# Altium schematic sheet TC_SMPS.SchDoc
size A4
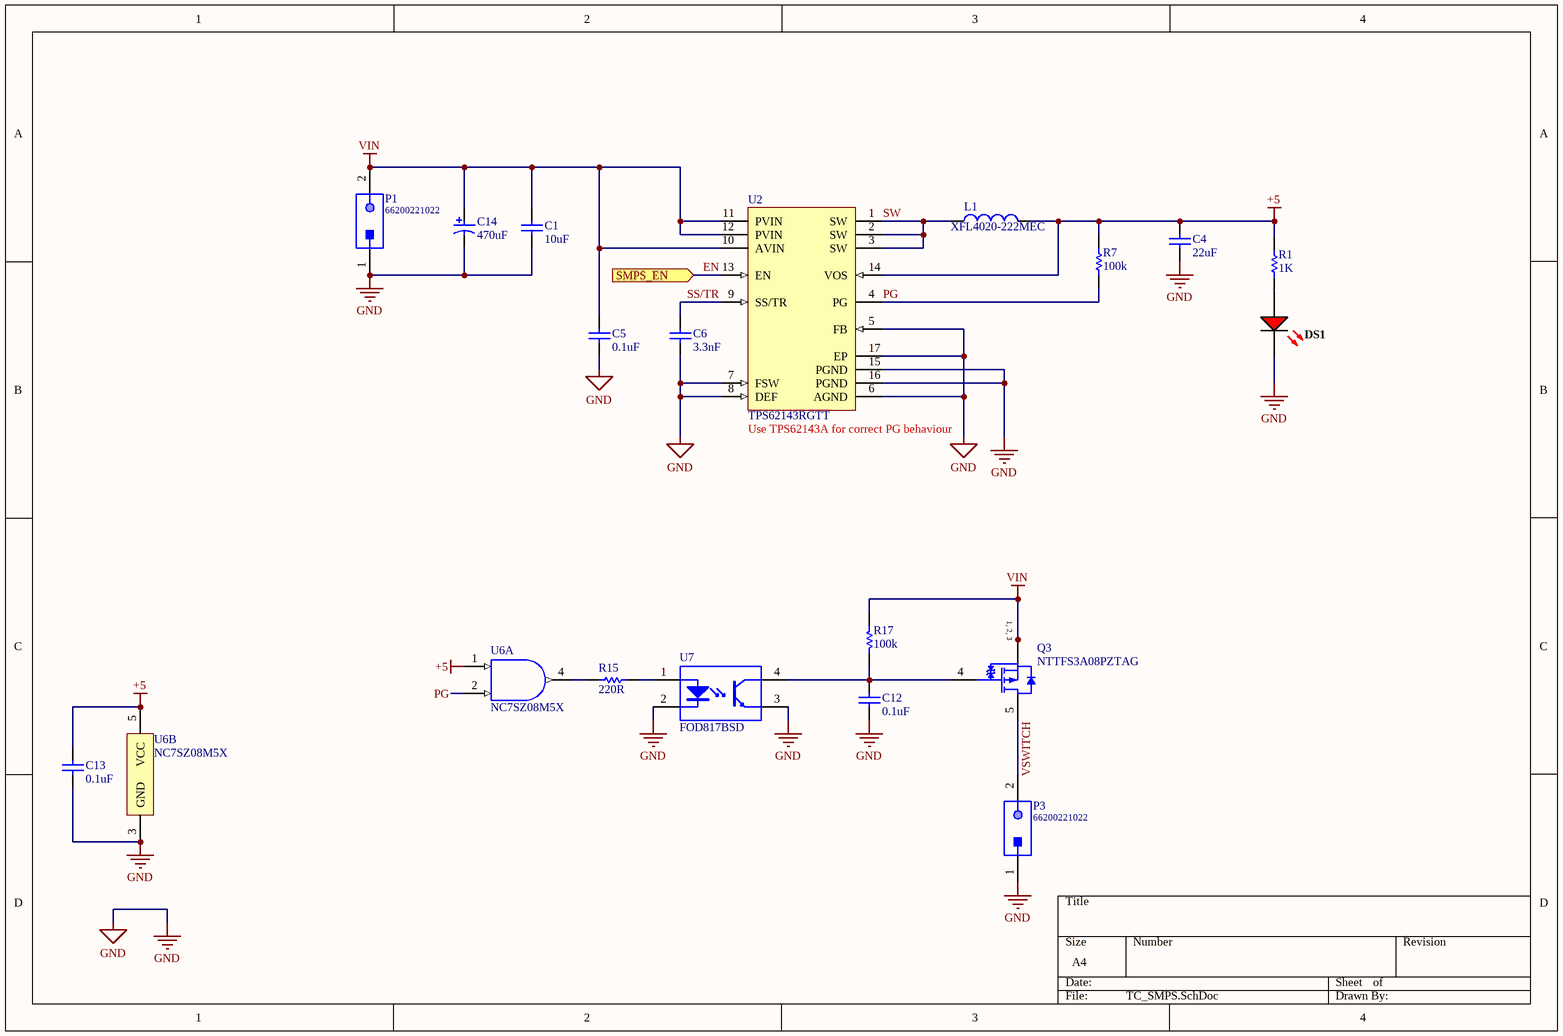
[diagram p0: TC_SMPS.SchDoc]

## Parts
C1  10uF  [CAPC1210(3225)210_M]
C4  22uF  [CAPC2013X95X45ML15T25]
C5  0.1uF  [CAPC1608X87X35NL15T15]
C6  3.3nF  [CAPC1608X87X35NL15T15]
C12  0.1uF  [CAPC1608X87X35NL15T15]
C13  0.1uF  [CAPC1608X87X35NL15T15]
C14  470uF  [PNSC-FK-V-F_V]
DS1  APG1608SURKC/T  [KING-LED0603-25-RED_V]  (value not drawn)
L1  XFL4020-222MEC  [COIL-IND-2_V]
P1  66200221022  [66200221022]
P3  66200221022  [66200221022]
Q3  NTTFS3A08PZTAG  [ONSC-WDFN-8-511AB_V]
R1  1K  [RESC1608X55X30LL15T15]
R7  100k  [RESC1608X55X25ML10T15]
R15  220R  [RESC1609X50X30LL10T20]
R17  100k  [RESC1608X55X25ML10T15]
U2  TPS62143RGTT  [RGT0016C_V]
U6  NC7SZ08M5X  [FAIR-SOT23-5_V]  (parts A,B of 2)
U7  FOD817BSD  [FAIR-MDIP-4_V]

## Ports
SMPS_EN (in)

## Nets
+5: C4.2 C13.1 L1.2 R1.2 R7.2 U2.14(VOS) U6.1(A) U6.5(VCC)
GND: C1.1 C4.1 C5.2 C6.1 C12.2 C13.2 C14.2 DS1.2(K) P1.1 P3.1 U2.5(FB) U2.6(AGND) U2.7(FSW) U2.8(DEF) U2.15(PGND) U2.16(PGND) U2.17(EP) U6.3(GND) U7.2(CATHODE) U7.3(EMITTER)
VIN: C1.2 C5.1 C14.1 P1.2 Q3.1(S) Q3.2(S) Q3.3(S) R17.2 U2.10(AVIN) U2.11(PVIN) U2.12(PVIN)
EN: U2.13(EN) ; port SMPS_EN
PG: R7.1 U2.4(PG) U6.2(B)
SS/TR: C6.2 U2.9(SS/TR)
SW: L1.1 U2.1(SW) U2.2(SW) U2.3(SW)
VSWITCH: P3.2 Q3.5(D)
NetC12_1: C12.1 Q3.4(G) R17.1 U7.4(COLLECTOR)
NetDS1_1: DS1.1(A) R1.1
NetR15_1: R15.1 U6.4(Y)
NetR15_2: R15.2 U7.1(ANODE)

## Notes on the sheet
- (near U2) Use TPS62143A for correct PG behaviour
- (in symbol CMP-1058-01043-1) 1, 2, 3

## Library data of the parts
C1 = CMP-1038-02235-1: CAP 10uF 35V ±20% 1210 (3225 Metric) Thickness 2.1mm SMD; Tolerance: Â±20%; Case-Metric: 3225; Case-EIA: 1210; Technology: SMT; Rated Voltage: 35 V; Value: 10uF; Max Thickness: 2.1 mm
C4 = CMP-2007-00096-1: Manufacturer: Murata; Part Number: GRM219R61A226MEA0D
C5 C12 C13 = CMP-2006-03300-1: Part Number: C0603X104K5RACTU; Manufacturer: Kemet
C6 = CMP-2006-03881-1: Part Number: C0603C332K5RAC7867; Manufacturer: Kemet
C14 = CMP-2000-06204-1: Aluminum Electrolytic Capacitor, 470 uF, +/- 20%, 16 V, 2-Pin SMD (Size Code F), -55 to 105 degC, RoHS, Tape and Reel; Manufacturer: Panasonic; Capacitance: 470µF; Type: Can; Ripple Current: 600mA; Lifetime@Temperature: 2000Hrs@105°C; Impedance: 0.16O; Rated Voltage: 16V; Manufacturer URL: http://www.panasonic.com/; Package Description: 2-Pin Electrolytic Aluminum Capacitor, Body 8.3 x 8.3 mm; Operating Temp-Max: 105°C; Mounting Technology: SurfaceMount; Operating Temp Range: -55to+105°C; Datasheet Version: 03/2016; Series: FK; Package Reference: FK-V-F; Case Size/Dimension: Ø8x10.2mm; Package URL: http://industrial.panasonic.com/cdbs/www-data/pdf/RDE0000/DME0000COL48.pdf; Datasheet URL: http://industrial.panasonic.com/cdbs/www-data/pdf/RDE0000/ABA0000C1181.pdf
DS1 = CMP-0404-00004-1: Ultra Thin Hyper Red SMD Chip LED Lamp, 2 to 2.5 V, -40 to 85 degC, Body 1.6 x 0.8 mm, 0.28 mm Thickness, RoHS, Tape and Reel; Manufacturer: Kingbright; Dice: Hyper Red (AlGaInP); IR (Max): 10 uA; Luminous Intensity mcd @ 20 mA (Min.): 55; Lens Type: Water Clear; Viewing Angle: 120; Luminous Intensity mcd @ 20 mA (Typ.): 110; ComponentLink2Description: Datasheet; ComponentLink3URL: http://www.kingbrightusa.com/images/catalog/SPEC/APG1608SURKC-T.pdf; Packing: Tape and Reel; Mounting Technology: Surface Mount; PackageVersion: Rev. V.5A; ComponentLink1Description: Manufacturer URL; ComponentLink2URL: http://www.kingbrightusa.com/images/catalog/SPEC/APG1608SURKC-T.pdf; ComponentLink3Description: Package Specification; PackageDescription: 2-Pin SMT, Body 1.6 x 0.8 mm, 0.28mm Thickness, Red; PackageReference: LED0603-25-RED; DatasheetVersion: Rev. V.5A; Operating Temperature: -40 to 85 degC; PartNumber: APG1608SURKC/T; ComponentLink1URL: http://www.kingbrightusa.com/; Forward Voltage: 2 to 2.5 V; RoHS: TRUE
L1 = CMP-2000-05090-2: High Temperature Shielded Power Inductor, 2.2 uH, +/- 20 %, -40 to 125 degC, 2-Pin SMD, RoHS, Tape and Reel; Manufacturer: Coilcraft; Case Length: 4.3mm; Case Height: 2.1mm; Tolerance: 20%; Self Resonant Frequency: 38MHz; Inductance: 2.2uH; Maximum DC Resistance: 23.5mOhms; Test Frequency: 100kHz; Core Material: Composite; Maximum DC Current: 8A; Case Width: 4.3mm; Series: XFL4020; RoHS: Details; Termination Style: SMD/SMT; PartNumber: XFL4020-222MEC; Datasheet Version: Jul-12; Shielding: Shielded; Datasheet URL: http://www.mouser.com/ds/2/597/xfl4020-270756.pdf; Dimensions: 4.3mmWx4.3mmLx2.1mmH; Operating Temperature Range: -40Cto+125C; Packaging: Reel; Product: PowerInductors; Manufacturer URL: http://www.coilcraft.com/
P1 P3 = CMP-1502-00364-1: THT Male Header WR-MPC3, with Snap-in Plastic Pegs, Right Angled, Dual Row, pitch 3 mm, 2 pins; Manufacturer: Wurth Elektronik; Pitch: 3mm; Pin Number: 2; Working Voltage: 250VAC; Contact Resistance: 10mOhm; Part Number: 66200221022; Manufacturer URL: http://www.we-online.de; Mounting Technology: THT; Datasheet URL: https://katalog.we-online.de/em/datasheet/6620xx21022.pdf; Package Reference: 66200221022; Packaging: Tube; Orientation: RightAngled; Operating Temperature: -40to105degC; Gender: Male; Publisher: WurthElektronik
Q3 = CMP-1058-01043-1: Power MOSFET, -20 V, -15 A, Single P-Channel, 8-Pin WDFN, Pb-Free, Tape and Reel; Manufacturer: On Semiconductor; ID Max (A): 15; V(BR)DSS Min (V): 20; Coss Typ (pF): 600; Ciss Typ (pF): 5000; Qrr Typ (nC): 234; Crss Typ (pF): 540; Channel Polarity: P Channel; VGS(th) Max (V): 1; VGS Max (V): 8; ComponentLink2URL: http://www.onsemi.cn/pub_link/Collateral/NTTFS3A08PZ-D.PDF; ComponentLink1URL: http://www.onsemi.com/; ComponentLink2Description: Datasheet; Package Type: u8FL / WDFN-8; DatasheetVersion: Rev. 2; ComponentLink3URL: http://www.onsemi.com/pub_link/Collateral/511AB.PDF; Configuration: Single; RoHS: Pb-Free; ComponentLink3Description: Package Specification; PartNumber: NTTFS3A08PZTAG; PackageDescription: 8-Pin Small Outline No-Lead, Body 3.05 x 3.05 mm, Pitch 0.65 mm; Packing: Tape and Reel; PackageVersion: Rev. D, 04/2012; ComponentLink1Description: Manufacturer URL; PackageReference: WDFN-8-511AB; Mounting Technology: Surface Mount
R1 = CMP-2000-00180-1: Part Number: ERJ-3EKF1001V; Manufacturer: Panasonic
R7 R17 = CMP-2100-03662-1: Chip Resistor, 100 KOhm, +/- 1%, 0.1 W, -55 to 155 degC, 0603 (1608 Metric), RoHS, Tape and Reel; Manufacturer: Yageo; Power Rating: 100mW; Voltage Rating: 50V; Temperature Coefficient: 100ppm/degreesC; Datasheet Version: Rev. 5, 10/2016; Height: 0.45mm; Lead Free: LeadFree; Manufacturer URL: http://www.yageo.com/; Package Reference: 0603; Depth: 0.8mm; RoHSCompliant: true; Composition: ThickFilm; Military Standard: Not; Resistance: 100KOhm; Case/Package: 0603; Packaging: TapeandReel; Case Code (Imperial): 0603; Voltage Rating (DC): 50V; Case Code (Metric): 1608; Tolerance: 1%; Termination: SMD/SMT; Min Operating Temperature: -55degC; Number of Pins: 2; Length: 1.6mm; Width: 0.8mm; Datasheet URL: http://www.yageo.com/NewPortal/yageodocoutput?fileName=/pdf/R-Chip/PYu-RC_Group_51_RoHS_L_5.pdf; Package Description: 2-Pin Surface Mount Device, Body 1.6 x 0.8 mm; Max Operating Temperature: 155degC; REACH SVHC: NoSVHC
R15 = CMP-2000-03085-1: Part Number: CRCW0603220RFKEA; Manufacturer: Vishay Dale
U2 = CMP-0323-00125-3: Buck Step Down Regulator with 3 to 17 V Input and 5 V Output, -40 to 85 degC, 16-Pin QFN (RGT), Green (RoHS & no Sb/Br); Manufacturer: Texas Instruments; Vin(Max)(V): 17; Synchronous Rectification: TRUE; Vout(Min)(V): 5; Vin(Min)(V): 3; Duty Cycle(Max)(%): 100; Iout(Max)(A): 2; Regulated Outputs(#): 1; Iq(Typ)(mA): 0.017; Rating: Catalog; SubFamily: Step-Down Regulator; ComponentLink2Description: Package Specification; PackageVersion: revH, Oct-2011; ComponentLink1Description: Datasheet; ComponentLink3Description: URL Link1; Code_JEDEC: MO-220; Mounting Technology: Surface Mount; PartNumber: TPS62143RGTT; Vout(Max)(V): 5; Topology: Buck; ComponentLink1URL: http://www.ti.com/general/docs/lit/getliterature.tsp?genericPartNumber=TPS62143&fileType=pdf; Eco-Plan: Green (RoHS & no Sb/Br); Preset Vout(V): 5; PackageReference: RGT0016C; Switch Current Limit(Typ)(A): 3; ComponentLink2URL: http://www.ti.com/litv/pdf/mpqf119g; DatasheetVersion: SLVSAJ0; ComponentLink3URL: Samples URL:http://www.ti.com/product/tps54611#samples; PackageDescription: 16-Pin Plastic Quad Flat No-Lead, 3 x 3 mm Body, 0.5 mm Pitch, 1.7 x 1.7 mm Exposed Pad
U6 = CMP-2000-06815-1: TinyLogic(R) UHS 2-Input AND Gate, 1.65 to 5.5 V, -40 to 85 degC, 5-Pin SOT23, RoHS, Tape and Reel; Manufacturer: FairchildSemiconductor; Logic Family: NC7SV; Package Version: 08/2015; Low Level Output Current: 32mA; Number of Gates: 1Gate; Number of Input Lines: 2Input; Propagation Delay Time: 5.2ns; Unit Weight: 0.001058oz; High Level Output Current: -32mA; Supply Voltage - Min: 1.65V; Supply Voltage - Max: 5.5V; Number of Output Lines: 1Output; Maximum Operating Temperature: +85C; Package Reference: SOT23-5; Package URL: https://www.fairchildsemi.com/package-drawings/MA/MA05B.pdf; Package Description: 5-Pin Small Outline Transistor, Body 2.9 x 1.6 mm, Pitch 0.95 mm; Datasheet URL: https://www.fairchildsemi.com/datasheets/NC/NC7SZ08.pdf; Manufacturer URL: https://www.fairchildsemi.com/; Product Category: LogicGates; Series: TinyLogic; Mounting Technology: SurfaceMount; RoHS: True; Packaging: Reel; Mounting Style: SMD/SMT; Logic Type: 2-InputAND; Minimum Operating Temperature: -40C; <PCN>: http://www.mouser.com/PCN/3.26.10LTBDFairchild.pdf; Brand: FairchildSemiconductor; Product: Single-FunctionGate; Package / Case: SOT-23; Datasheet Version: Rev. 1.0.3, 09/2009; Logic Function: AND
U7 = CMP-2000-06280-1: Phototransistor Optocoupler, 4 us Rise, 3 us Fall, 5000 Vrms, -55 to 110 degC, 4-Pin MDIP, RoHS, Tape and Reel; Manufacturer: Fairchild Semiconductor; Input Type: DC; Maximum Collector Current: 50mA; Product Width: 7mm(Max); Minimum Current Transfer Ratio: 130%; Typical Forward Voltage: 1.2V; Maximum Power Dissipation: 200mW; Maximum Collector Emitter Voltage: 70V; Maximum Rise Time: 18us; Package Version: 10/2014; Typical Fall Time: 3us; Pin_Count: 4; Maximum Forward Voltage: 1.4V; Maximum Current Transfer Ratio: 260%; Maximum Collector Emitter Saturation Voltage: 200mV; Maximum Reverse Voltage: 6V; Number of Channels per Chip: 1; Typical Rise Time: 4us; Product Height: 4mm(Max); Product Length: 5.1mm(Max); Maximum Input Current: 50mA; Family: FOD817; Output Device: Transistor; Maximum Operating Temperature: 110C; Package URL: https://www.fairchildsemi.com/package-drawings/N0/N04C.pdf; Supplier_Package: PDIPSMDBlack; Minimum Isolation Voltage: 5000Vrms; Mounting Technology: SurfaceMount; Product Type: TransistorandPhotovoltaicOutputPhotoCouplers; Packaging: TapeandReel; Package Reference: MDIP 4L; Output Type: DC; Mounting: SurfaceMount; Package Description: 4-Pin Surface Mount Device, Body 6.5 x 4.6 mm, Pitch 2.54 mm; Maximum Fall Time: 18us; Datasheet URL: https://www.fairchildsemi.com/datasheets/FO/FOD817B.pdf; Datasheet Version: Rev. 2.8, 11/2015; Minimum Operating Temperature: -55C; Manufacturer URL: https://www.fairchildsemi.com/